# EasyEDA Pro project NFC1扩展板挖宝.epro

# Board NFC1扩展板
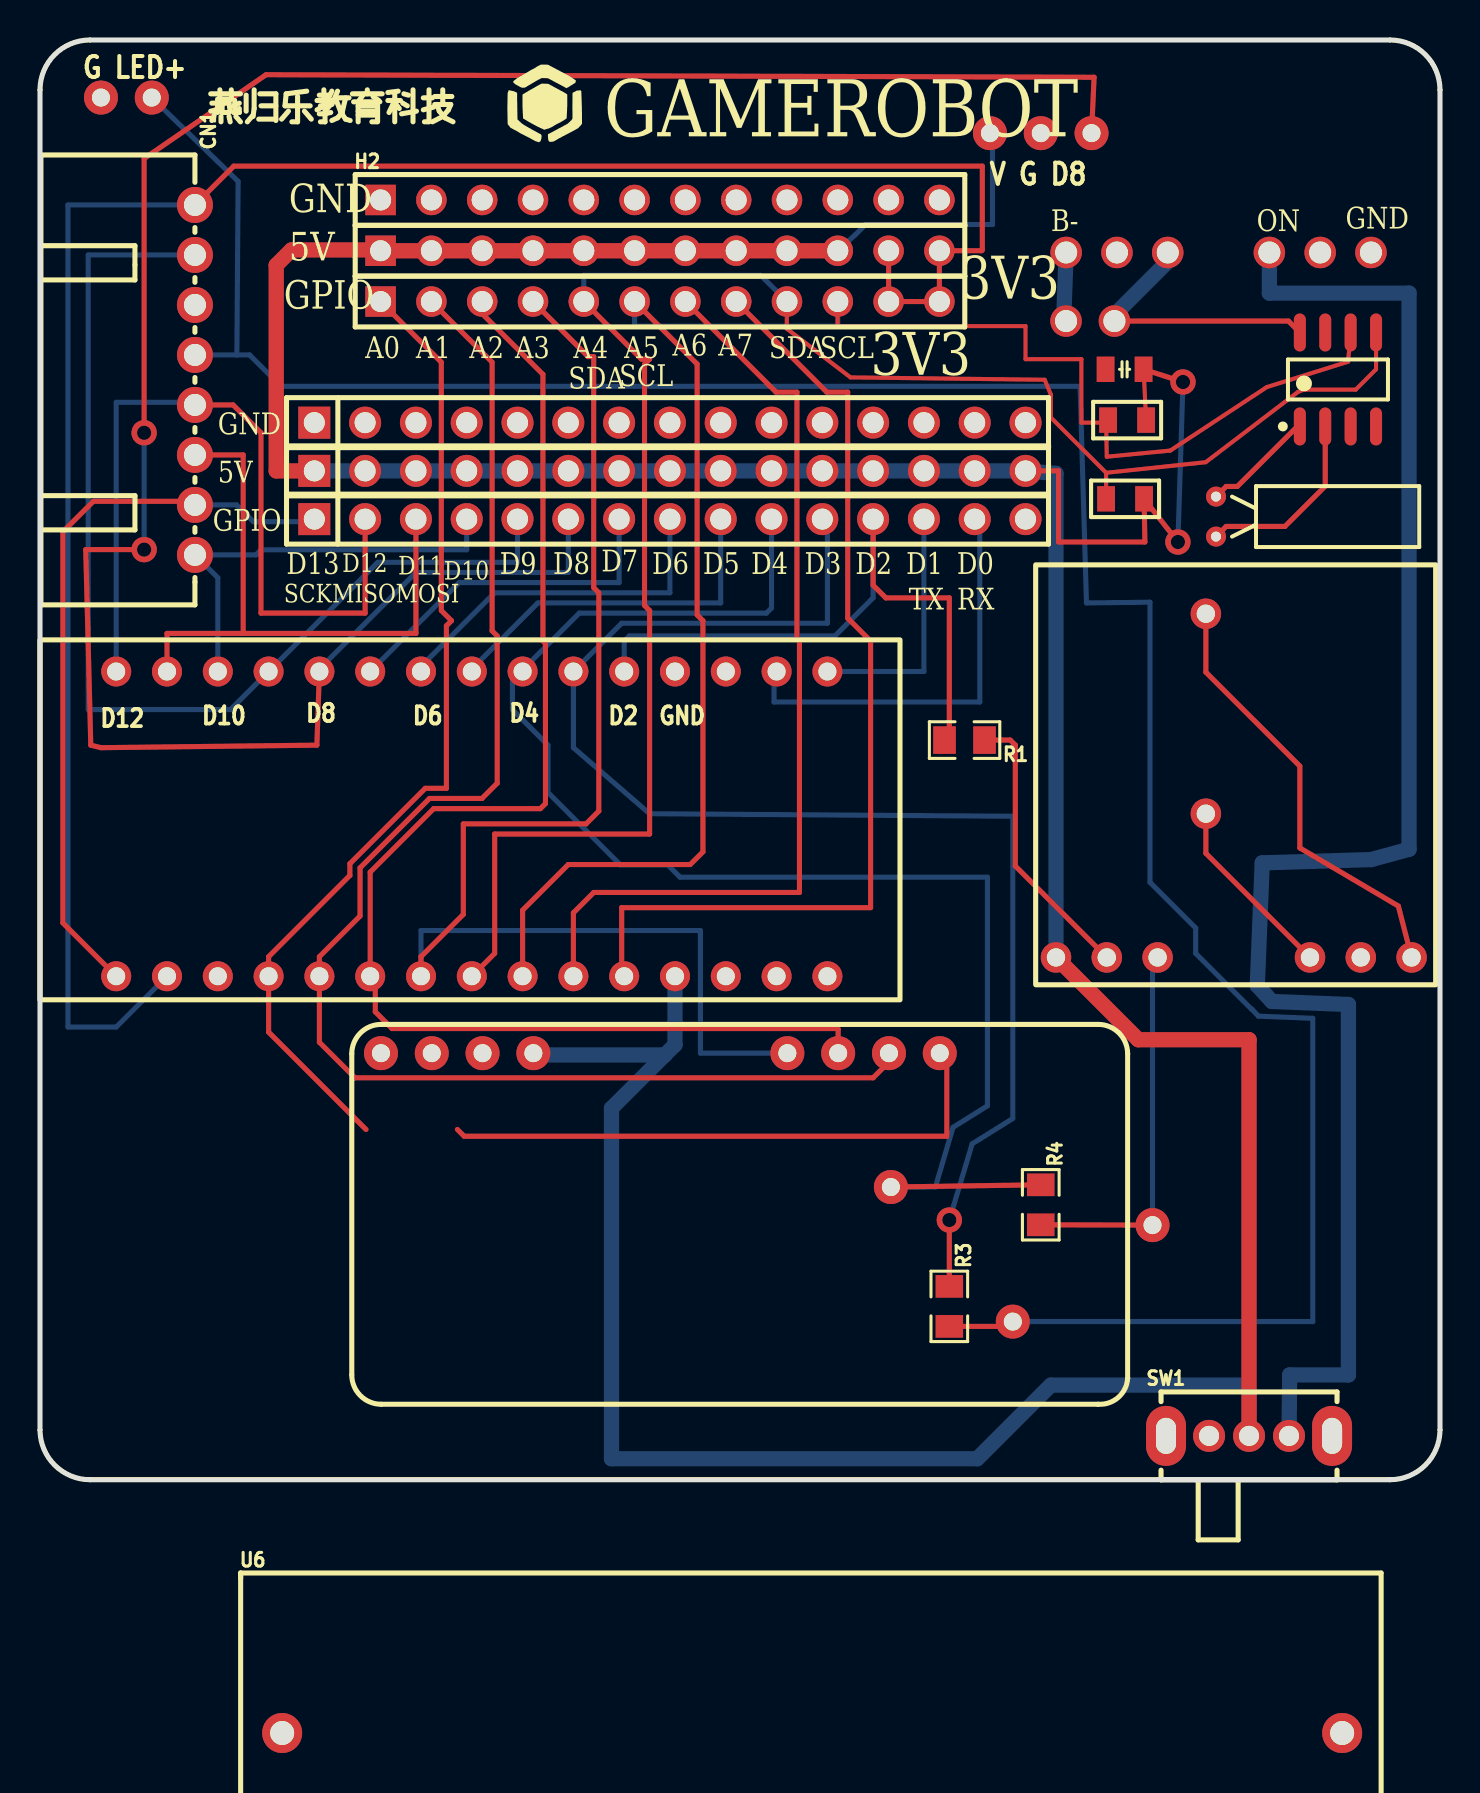
[diagram p0: board, top side]
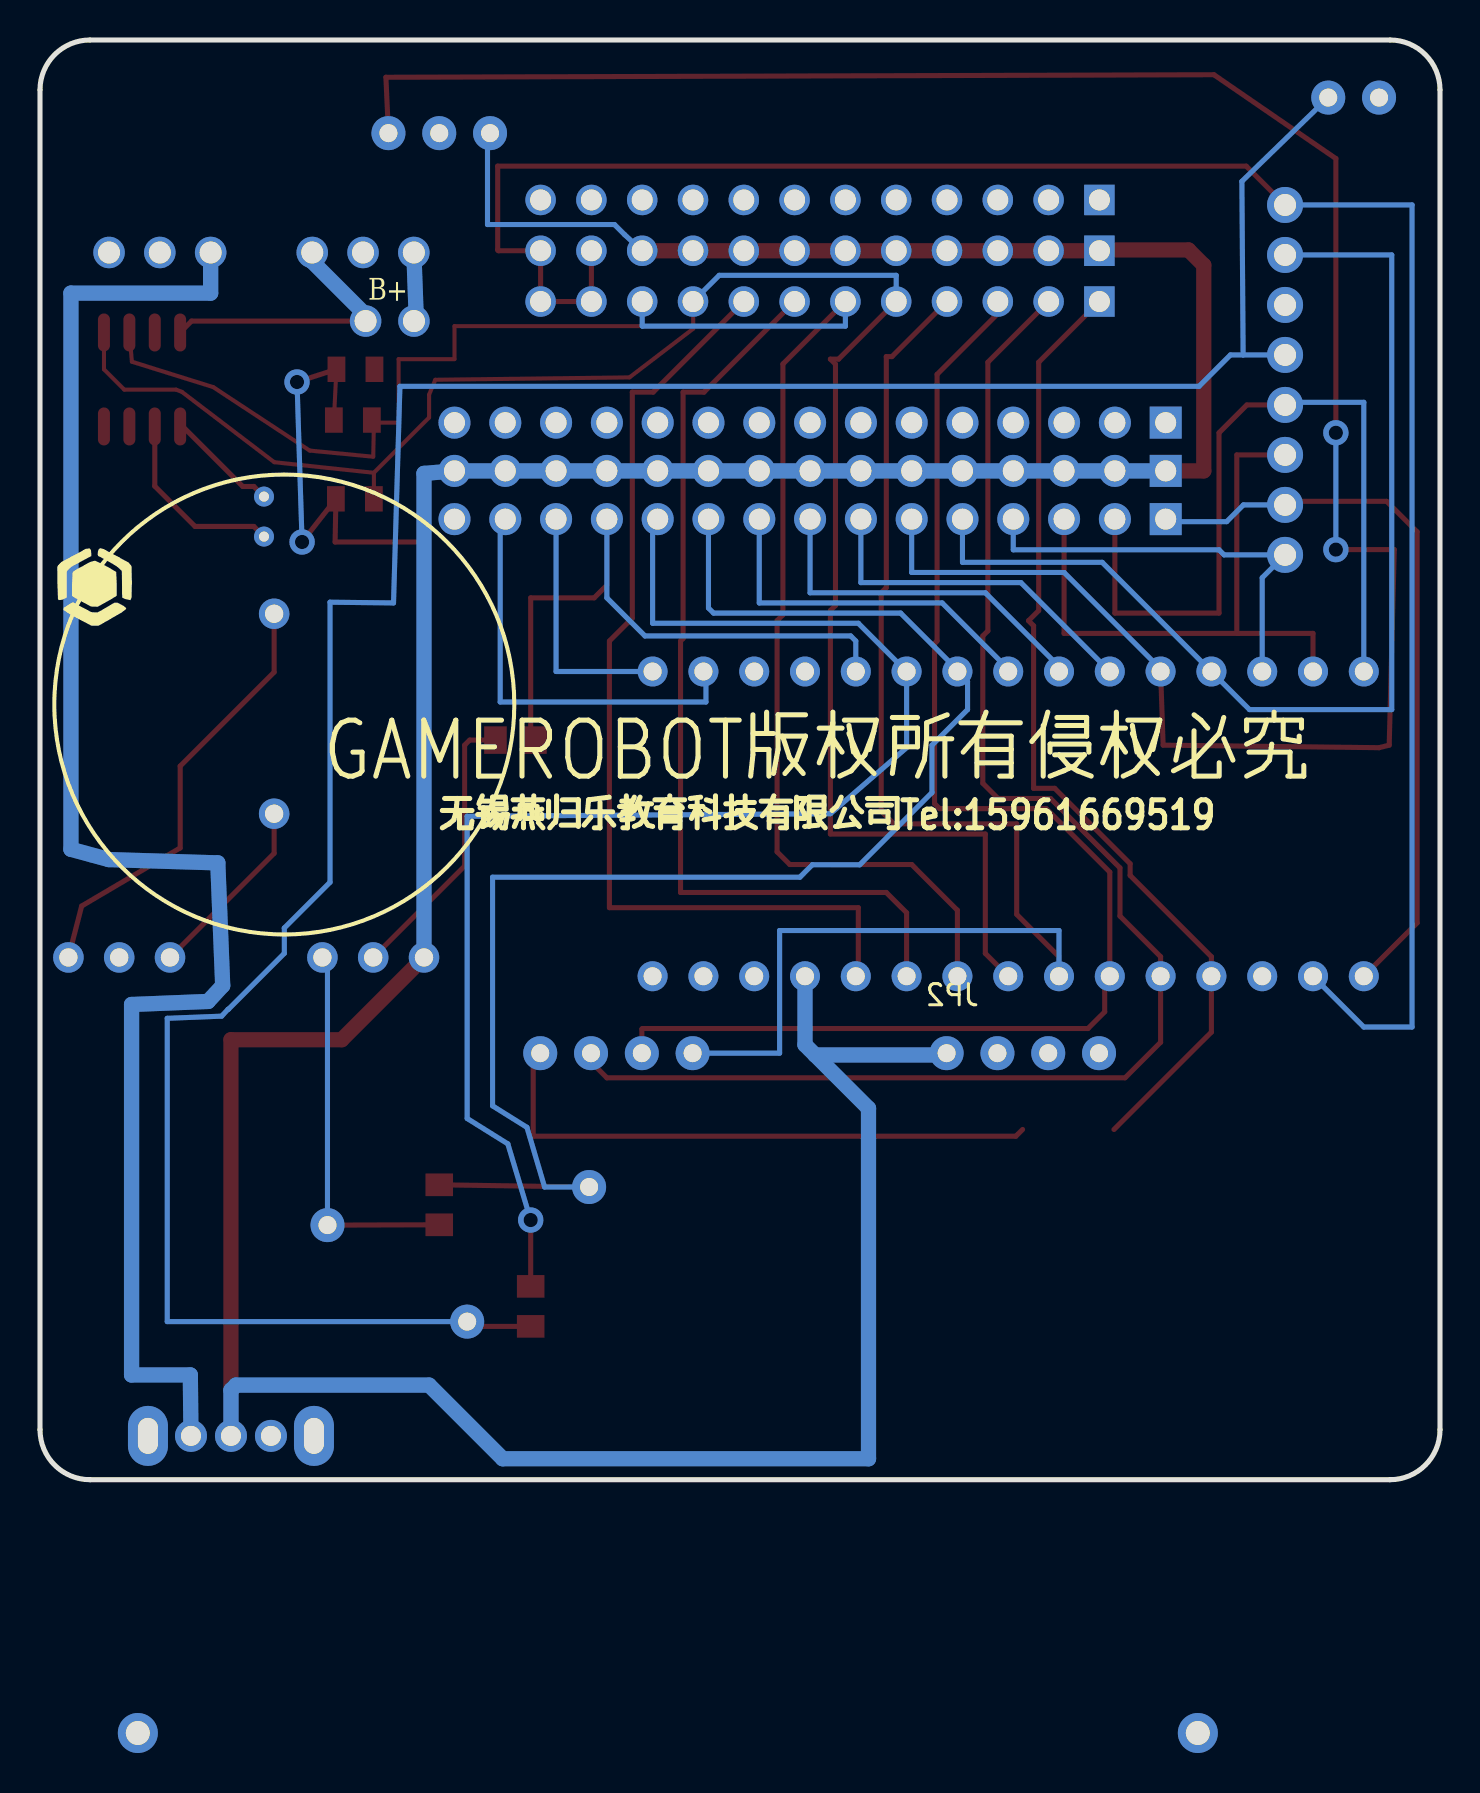
[diagram p1: board, bottom side, seen from below]

Outline 70 x 72 mm; copper layers: Top Layer, Bottom Layer. Coordinates in mm from the lower left corner of the outline.
Outline path: 0,69.5 0,2.5 arc(0.73,0.73) 2.5,0 67.5,0 arc(69.27,0.73) 70,2.5 70,69.5 arc(69.27,71.27) 67.5,72 2.5,72 arc(0.73,71.27) 0,69.5
Stack: Top Layer 0.0356mm / Dielectric1 0.32mm FR-4 er 4.8 / Bottom Layer 0.0356mm

## Design rules (mm)
template: 用户自定义配置
spacing Clearance (default): track to track 0.254, other pairs 0 to 0.254
track width Width (default): min 0.203, default 0.254, max 0.762
differential pair DiffPairsRouting (default): width min 0.381, default 0.381, max 0.381; gap min 0.254, default 0.254
via RoutingVias (default): diameter min 1.27, default 1.27, max 1.27; hole min 0.711, default 0.711, max 0.711

## Placement (name value [footprint] x y rotation side)
C20  104  [C 0805_L]  54.23 55.53 180 top
CN1  HX25003-8WAP  [CONN-TH_8P-P2.50_HX25003-8WAP]  7.75 55 270 top
H2  -  [HDR-TH_12P-P2.54-V-M]  31 64 0 top
H2#2  -  [HDR-TH_15P-P2.54-V-M]  31.5 52.86 0 top
H2#3  -  [HDR-TH_15P-P2.54-V-M]  31.5 50.45 0 top
H2#4  -  [HDR-TH_15P-P2.54-V-M]  31.5 48.04 0 top
H3  -  [HDR-TH_12P-P2.54-V-M]  31 61.46 0 top
H4  -  [HDR-TH_12P-P2.54-V-M]  31 58.92 0 top
JP2  Header-Male-2.54_1x15  [hdr-th_15p-p2.54-v-a]  21.59 25.18 180 top
JP3  Header-Male-2.54_1x15  [hdr-th_15p-p2.54-v-a]  21.59 40.42 180 top
NOREF  -  [Pad_e1]  47.5 67.34 0 top
NOREF#2  -  [Pad_e804]  64.01 61.37 0 top
NOREF#3  -  [Pad_e811]  53.85 61.37 0 top
NOREF#4  -  [Pad_e73]  61.47 61.37 0 top
NOREF#5  -  [Pad_ie26]  68.58 26.12 0 top
NOREF#6  -  [Pad_e23]  55.63 12.73 0 top
NOREF#7  -  [Pad_e749]  48.64 7.91 180 top
NOREF#8  -  [Pad_e82]  51.3 57.94 0 top
NOREF#9  -  [Pad_e423]  5.59 69.12 180 top
NOREF#10  -  [Pad_e232]  58.29 33.31 270 top
NOREF#11  -  [Pad_e75]  56.39 61.37 0 top
NOREF#12  -  [Pad_e425]  3.05 69.12 180 top
NOREF#13  -  [Pad_e9]  50.04 67.34 0 top
NOREF#14  -  [Pad_ie20]  63.5 26.12 0 top
NOREF#15  -  [Pad_e230]  58.29 43.31 270 top
NOREF#16  -  [Pad_ie16]  55.88 26.12 0 top
NOREF#17  -  [Pad_ie46]  24.67 21.33 180 top
NOREF#18  -  [Pad_ie15]  53.34 26.12 0 top
NOREF#19  -  [Pad_e12]  52.58 67.34 0 top
NOREF#20  -  [Pad_ie49]  17.05 21.33 180 top
NOREF#21  -  [Pad_ie12]  50.8 26.12 0 top
NOREF#22  -  [Pad_e81]  53.72 57.94 0 top
NOREF#23  -  [Pad_ie47]  22.13 21.33 180 top
NOREF#24  -  [Pad_ie45]  42.54 14.64 180 top
NOREF#25  -  [Pad_e7]  39.91 21.33 0 top
NOREF#26  -  [Pad_e76]  51.31 61.37 0 top
NOREF#27  -  [Pad_ie48]  19.59 21.33 180 top
NOREF#28  -  [Pad_ie25]  66.04 26.12 0 top
NOREF#29  -  [Pad_e8]  37.37 21.33 0 top
NOREF#30  -  [Pad_e6]  42.45 21.33 0 top
NOREF#31  -  [Pad_e5]  44.99 21.33 0 top
NOREF#32  -  [Pad_e67]  66.55 61.37 0 top
R1  10K  [R0805]  46.23 36.99 180 top
R3  1K  [R0805]  45.47 8.67 270 top
R4  1K  [R0805]  50.04 13.75 270 top
R16  10K  [R 0805_L]  54.36 52.99 0 top
R17  10K  [R 0805_L]  54.25 49.05 0 top
SW1  -  [拨动开关_侧]  60.45 2.19 0 top
U5  DS1307Z+T&R  [S8+2_L]  64.9 55.02 90 top
U6  1节5号电池座带焊针  [BAT-TH_L57.0-W16.0-P53.00]  38.61 -12.67 0 top
Y3  32.768kHz  [OSC-3x8-WI-A]  58.8 48.17 270 top

## Footprints (pads in the part's own frame, mm; a bottom-side part is the same pattern mirrored in y, then rotated)
BAT-TH_L57.0-W16.0-P53.00
  round 2 hole 1.2: 1(-26.5,0) 2(26.5,0)
C 0805_L
  rect 0.889x1.27 smd: 1(-0.95,0) 2(0.95,0)
CONN-TH_8P-P2.50_HX25003-8WAP
  round 1.8 hole 1.1: 1(-8.75,0) 2(-6.25,0) 3(-3.75,0) 4(-1.25,0) 5(1.25,0) 6(3.75,0) 7(6.25,0) 8(8.75,0)
HDR-TH_12P-P2.54-V-M
  rect 1.524x1.524 hole 1.05: 1(-13.97,0)
  round 1.524 hole 1.05: 2(-11.43,0) 3(-8.89,0) 4(-6.35,0) 5(-3.81,0) 6(-1.27,0) 7(1.27,0) 8(3.81,0) 9(6.35,0) 10(8.89,0) 11(11.43,0) 12(13.97,0)
hdr-th_15p-p2.54-v-a
  round 1.5 hole 0.9: 1(-17.78,0) 2(-15.24,0) 3(-12.7,0) 4(-10.16,0) 5(-7.62,0) 6(-5.08,0) 7(-2.54,0) 8(0,0) 9(2.54,0) 10(5.08,0) 11(7.62,0) 12(10.16,0) 13(12.7,0) 14(15.24,0) 15(17.78,0)
HDR-TH_15P-P2.54-V-M
  rect 1.6x1.6 hole 1.05: 1(-17.78,0)
  round 1.6 hole 1.05: 2(-15.24,0) 3(-12.7,0) 4(-10.16,0) 5(-7.62,0) 6(-5.08,0) 7(-2.54,0) 8(0,0) 9(2.54,0) 10(5.08,0) 11(7.62,0) 12(10.16,0) 13(12.7,0) 14(15.24,0) 15(17.78,0)
OSC-3x8-WI-A
  round 1 hole 0.5: 1(1,0) 2(-1,0)
Pad_e1
  round 1.7 hole 0.9: 21(0,0)
Pad_e5
  round 1.7 hole 0.9: 1(0,0)
Pad_e6
  round 1.7 hole 0.9: 2(0,0)
Pad_e7
  round 1.7 hole 0.9: 3(0,0)
Pad_e8
  round 1.7 hole 0.9: 4(0,0)
Pad_e9
  round 1.7 hole 0.9: 22(0,0)
Pad_e12
  round 1.7 hole 0.9: 23(0,0)
Pad_e23
  round 1.7 hole 0.9: 10(0,0)
Pad_e67
  round 1.575 hole 1.1: 1(0,0)
Pad_e73
  round 1.575 hole 1.1: 3(0,0)
Pad_e75
  round 1.575 hole 1.1: 3(0,0)
Pad_e76
  round 1.575 hole 1.1: 3(0,0)
Pad_e81
  round 1.575 hole 1.1: 3(0,0)
Pad_e82
  round 1.575 hole 1.1: 3(0,0)
Pad_e230
  round 1.524 hole 0.914: 2(0,0)
Pad_e232
  round 1.524 hole 0.914: 1(0,0)
Pad_e423
  round 1.7 hole 0.9: 21(0,0)
Pad_e425
  round 1.7 hole 0.9: 21(0,0)
Pad_e749
  round 1.7 hole 0.9: 1(0,0)
Pad_e804
  round 1.575 hole 1.1: 3(0,0)
Pad_e811
  round 1.575 hole 1.1: 3(0,0)
Pad_ie12
  round 1.524 hole 0.914: 12(0,0)
Pad_ie15
  round 1.524 hole 0.914: 12(0,0)
Pad_ie16
  round 1.524 hole 0.914: 12(0,0)
Pad_ie20
  round 1.524 hole 0.914: 12(0,0)
Pad_ie25
  round 1.524 hole 0.914: 11(0,0)
Pad_ie26
  round 1.524 hole 0.914: 11(0,0)
Pad_ie45
  round 1.7 hole 0.9: 0(0,0)
Pad_ie46
  round 1.7 hole 0.9: 0(0,0)
Pad_ie47
  round 1.7 hole 0.9: 0(0,0)
Pad_ie48
  round 1.7 hole 0.9: 0(0,0)
Pad_ie49
  round 1.7 hole 0.9: 0(0,0)
R0805
  rect 1.133x1.377 smd: 1(-1,0) 2(1,0)
R 0805_L
  rect 0.889x1.27 smd: 1(-0.95,0) 2(0.95,0)
S8+2_L
  oval 1.9x0.6 smd: 1(-2.35,1.905) 2(-2.35,0.635) 3(-2.35,-0.635) 4(-2.35,-1.905) 5(2.35,-1.905) 6(2.35,-0.635) 7(2.35,0.635) 8(2.35,1.905)
拨动开关_侧
  oval 1.6x1.6 hole 1.001: 1(-1.999,0) 2(0,0) 3(1.999,0)
  oval 1.999x2.999 hole 1.001x1.801: 4(4.151,0) 5(-4.151,0)

## Nets
3V3: CN1.1 H3.11 H3.12 H4.11 H4.12 JP2.14
GND: C20.2 CN1.3 H2.1 H2.2 H2.3 H2.4 H2.5 H2.6 H2.7 H2.8 H2.9 H2.10 H2.11 H2.12 H2#2.1 H2#2.2 H2#2.3 H2#2.4 H2#2.5 H2#2.6 H2#2.7 H2#2.8 H2#2.9 H2#2.10 H2#2.11 H2#2.12 H2#2.13 H2#2.14 H2#2.15 JP2.2 JP3.4 NOREF#12.21 NOREF#13.22 NOREF#27.0 NOREF#28.11 NOREF#32.1 U5.4
VCC: C20.1 H2#3.1 H2#3.2 H2#3.3 H2#3.4 H2#3.5 H2#3.6 H2#3.7 H2#3.8 H2#3.9 H2#3.10 H2#3.11 H2#3.12 H2#3.13 H2#3.14 H2#3.15 H3.1 H3.2 H3.3 H3.4 H3.5 H3.6 H3.7 H3.8 H3.9 H3.10 JP2.4 NOREF.21 NOREF#17.0 NOREF#21.12 R16.2 R17.2 SW1.2
VIN: JP2.1
A0: H4.1 JP2.12 NOREF#31.1
A1: H4.2 JP2.11 NOREF#30.2
A2: H4.3 JP2.10 NOREF#25.3
A3: H4.4 JP2.9 NOREF#29.4
A4/SDA: H4.5 H4.9 JP2.8 R17.1 U5.5
A5/SCL: H4.6 H4.10 JP2.7 R16.1 U5.6
A6: H4.7 JP2.6
A7: H4.8 JP2.5
AREF: JP2.13
B+: NOREF#11.3 NOREF#22.3 U5.8
B-: NOREF#8.3 NOREF#26.3
D0/RX: H2#4.14 JP3.2
D1/TX: H2#4.13 JP3.1
D1_2: U5.3
D2: H2#4.12 JP3.5 R1.2
D3: H2#4.11 JP3.6 R3.1
D4: H2#4.10 JP3.7 NOREF#24.0 R4.1
D5: H2#4.9 JP3.8
D6: H2#4.8 JP3.9
D7: H2#4.7 JP3.10
D8: H2#4.6 JP3.11 NOREF#19.23
D9: CN1.2 H2#4.5 JP3.12
D10/SS: CN1.8 H2#4.4 JP3.13
D11/MOSI: CN1.6 H2#4.3 JP3.14
D12/MISO: CN1.5 H2#4.2 JP3.15
D13/SCK: CN1.7 H2#4.1 JP2.15
LED+: CN1.4 NOREF#7.1 NOREF#9.21 R3.2
ON: NOREF#4.3 SW1.3
RX1: NOREF#18.12 R1.1
SPK1: NOREF#10.1 NOREF#14.12
SPK2: NOREF#5.11 NOREF#15.2
TX2: NOREF#6.10 NOREF#16.12 R4.2
Y1: U5.1 Y3.2
Y2: U5.2 Y3.1

Pads without a net: H2#4 15; JP2 3; JP3 3; NOREF#2 3; NOREF#3 3; NOREF#20 0; NOREF#23 0; SW1 1 4 5; U5 7; U6 1 2

## Via types
v1: diameter 1.27, hole 0.711, Top Layer to Bottom Layer, 5 vias

## Routing (per net, layer and track width the routed paths; a pad name or vN(x,y) marks a point on that pad's centre or on a via; arc(x,y) is an arc through that point)
3V3: length 107.6
  Top Layer w0.254: CN1.1 9.69,65.69 47.12,65.69 47.12,61.5 47.08,61.46 H3.12 H4.12 H4.11 H3.11
  Bottom Layer w0.254: JP2.14 3.81,22.64 1.4,22.64 1.4,63.75 CN1.1
VCC: length 240.8
  Top Layer w0.203: C20.1 R16.2
  Top Layer w0.254: C20.1 v1(57.15,54.9) ; H2#3.15 50.93,50.45 50.93,46.89 55.25,46.89 R17.2 v1(56.9,46.89)
  Top Layer w0.762: H2#3.1 11.81,50.45 11.81,60.74 12.57,61.5 16.99,61.5 H3.1 H3.2 H3.3 H3.4 H3.5 H3.6 H3.7 H3.8 H3.9 H3.10 ; NOREF#21.12 54.91,22 60.45,22 SW1.2
  Bottom Layer w0.254: NOREF.21 47.62,67.22 47.62,62.77 41.28,62.77 40.77,62.26 H3.10 ; v1(57.15,54.9) v1(56.9,46.89)
  Bottom Layer w0.762: 31.24,21.24 28.57,18.57 28.57,1.05 46.86,1.05 50.55,4.73 60.2,4.73 60.45,4.48 SW1.2 ; 31.24,21.24 31.75,21.75 JP2.4 ; 31.24,21.24 24.76,21.24 NOREF#17.0 ; H2#3.1 H2#3.2 H2#3.3 H2#3.4 H2#3.5 H2#3.6 H2#3.7 H2#3.8 H2#3.9 H2#3.10 H2#3.11 H2#3.12 H2#3.13 H2#3.14 H2#3.15 50.8,50.32 NOREF#21.12
A0: length 78.2
  Top Layer w0.254: 20.87,17.51 21.21,17.18 45.34,17.18 45.34,20.98 NOREF#31.1 ; 16.3,17.51 11.43,22.38 JP2.12 11.43,26.16 15.49,30.22 15.49,30.81 19.26,34.58 20.32,34.58 20.32,42.7 20.57,42.96 20.07,43.47 20.07,55.88 H4.1
A1: length 73.6
  Top Layer w0.254: H4.2 22.61,55.88 22.61,42.45 22.86,42.2 22.86,34.83 22.1,34.07 19.47,34.07 16,30.6 16,28.19 13.97,26.16 JP2.11 13.97,21.88 15.75,20.1 41.66,20.1 42.45,20.89 NOREF#30.2
A2: length 68.4
  Top Layer w0.254: H4.3 22.11,58.31 25.15,55.28 25.15,41.94 25.27,41.81 25.27,33.81 25.02,33.56 19.69,33.56 16.51,30.39 JP2.10 16.76,24.92 16.76,23.4 17.6,22.56 39.88,22.56 39.91,22.53 NOREF#25.3
A3: length 69.3
  Top Layer w0.254: JP2.9 19.05,26.16 21.17,28.27 21.17,32.8 27.31,32.8 27.94,33.43 27.94,44.36 27.69,44.61 27.69,56.17 27.4,56.17 H4.4
  Bottom Layer w0.254: JP2.9 19.05,27.46 33.02,27.46 33.02,21.33 NOREF#29.4
A4/SDA: length 95
  Top Layer w0.203: R17.1 53.3,50.35 53.3,50.36 ; 53.3,50.36 58.29,50.89 62.9,54.4 63.2,54.52 65.79,54.52 66.8,55.53 U5.5 ; 53.3,50.36 53.3,50.36 50.55,53.12 50.55,54.26 50.23,55.01 40.52,55.13 37.34,57.56 H4.9
  Top Layer w0.254: JP2.8 22.73,26.32 22.73,32.29 30.48,32.29 30.48,43.47 30.23,43.72 30.23,55.78 30.48,56.04 30.07,56.04 H4.5
  Bottom Layer w0.254: H4.5 27.19,60.23 36.04,60.23 H4.9
A5/SCL: length 91
  Top Layer w0.203: U5.6 65.41,55.91 61.34,54.64 56.51,51.47 53.34,51.16 53.3,52.86 52.07,52.86 52.07,56.04 49.28,56.04 49.28,57.69 39.88,57.69 H4.10
  Top Layer w0.254: JP2.7 24.13,28.48 26.42,30.77 32.51,30.77 33.15,31.4 33.15,42.96 32.85,43.25 32.85,55.8 H4.6
  Bottom Layer w0.254: H4.10 39.89,57.7 39.88,57.69 29.73,57.69 H4.6
A6: length 47.4
  Top Layer w0.254: H4.7 36.8,54.39 37.85,54.39 37.85,42.07 37.97,41.94 37.97,29.37 27.69,29.37 26.67,28.35 JP2.6
A7: length 49.6
  Top Layer w0.254: JP2.5 29.08,25.31 29.08,28.61 41.53,28.61 41.53,41.94 40.39,43.08 40.39,54.39 39.34,54.39 H4.8
B+: length 14
  Top Layer w0.254: U5.8 62.42,57.94 NOREF#22.3
  Bottom Layer w0.762: NOREF#22.3 53.72,58.25 56.39,60.92 NOREF#11.3
B-: length 3.4
  Bottom Layer w0.762: NOREF#26.3 51.18,57.94
D0/RX: length 21.3
  Bottom Layer w0.254: H2#4.14 46.99,48.04 46.99,38.89 36.7,38.89 36.7,40.42 JP3.2
D1/TX: length 12.4
  Bottom Layer w0.254: JP3.1 44.2,40.42 H2#4.13
D2: length 33.5
  Top Layer w0.254: 44.97,36.99 45.47,37.48 45.47,44.1 42.29,44.1 41.66,44.74 H2#4.12
  Bottom Layer w0.254: JP3.5 29.21,41.94 29.46,42.2 39.75,42.2 41.66,44.1 H2#4.12
D3: length 70.8
  Top Layer w0.254: v1(45.47,12.99) R3.1
  Bottom Layer w0.254: H2#4.11 39.37,47.78 39.37,42.83 29.08,42.83 JP3.6 26.67,36.61 30.48,33.31 48.64,33.18 48.64,18.07 46.61,16.8 v1(45.47,12.99)
D4: length 75.3
  Top Layer w0.254: NOREF#24.0 R4.1
  Bottom Layer w0.254: H2#4.10 36.58,43.59 36.32,43.34 26.97,43.34 24.13,40.5 JP3.7 23.62,39.91 23.62,38.51 25.4,36.73 25.4,34.37 29.01,30.75 31.38,30.75 32,30.13 47.37,30.13 47.37,18.7 45.65,17.62 44.77,14.64 NOREF#24.0
D5: length 18.1
  Bottom Layer w0.254: JP3.8 21.59,40.55 24.89,43.85 34.04,43.85 H2#4.9
D6: length 17.9
  Bottom Layer w0.254: H2#4.8 31.5,44.36 22.73,44.36 19.05,40.67 JP3.9
D7: length 17.5
  Bottom Layer w0.254: JP3.10 20.96,44.86 28.96,44.86 H2#4.7
D8: length 116.1
  Top Layer w0.254: v1(5.21,46.51) 2.29,46.51 2.54,36.73 3.05,36.61 13.84,36.73 JP3.11 ; NOREF#19.23 52.71,70.14 11.3,70.26 5.21,66.07 v1(5.21,52.36)
  Bottom Layer w0.254: H2#4.6 26.42,45.37 18.8,45.37 13.97,40.55 JP3.11 ; v1(5.21,52.36) v1(5.21,46.51)
D9: length 54.7
  Bottom Layer w0.254: H2#4.5 23.88,45.88 16.89,45.88 JP3.12 9.53,38.51 2.41,38.51 2.41,61.25 CN1.2
D10/SS: length 21.5
  Bottom Layer w0.254: JP3.13 8.89,45.11 CN1.8 10.8,46.25 11.05,46.5 21.34,46.5 H2#4.4
D11/MOSI: length 31.4
  Top Layer w0.254: 10.1,42.32 18.8,42.32 H2#4.3 ; 10.1,42.32 6.35,42.32 JP3.14 ; 10.1,42.32 10.16,42.38 10.16,51.25 CN1.6
D12/MISO: length 40.3
  Top Layer w0.254: H2#4.2 16.26,43.34 11.05,43.34 11.05,52.36 9.66,53.75 CN1.5
  Bottom Layer w0.254: CN1.5 7.62,53.88 3.81,53.88 JP3.15
D13/SCK: length 37
  Top Layer w0.254: JP2.15 1.14,27.84 1.14,47.4 2.67,48.93 7.57,48.93 CN1.7
  Bottom Layer w0.254: CN1.7 9.83,48.75 10.67,47.91 13.59,47.91 H2#4.1
LED+: length 132.7
  Top Layer w0.254: NOREF#7.1 48.4,7.67 R3.2
  Bottom Layer w0.254: 9.84,56.25 CN1.4 ; 9.84,56.25 9.91,64.93 NOREF#9.21 ; 9.84,56.25 10.48,56.25 12.05,54.68 52,54.68 52.32,43.85 55.5,43.88 55.5,29.88 57.78,27.59 57.78,26.32 60.58,23.53 60.6,23.53 60.92,23.18 63.64,23.07 63.64,7.91 NOREF#7.1
ON: length 79.8
  Bottom Layer w0.762: SW1.3 62.48,5.24 65.42,5.24 65.42,23.77 61.6,23.92 60.87,24.71 61.11,30.85 66.56,31.01 68.45,31.53 68.45,59.34 61.47,59.34 NOREF#4.3
RX1: length 14.4
  Top Layer w0.254: NOREF#18.12 48.77,30.69 48.77,36.73 48.51,36.99 46.97,36.99
SPK1: length 9.3
  Top Layer w0.254: NOREF#14.12 58.29,31.33 NOREF#10.1
SPK2: length 22
  Top Layer w0.254: NOREF#5.11 67.92,28.69 62.99,31.59 62.99,35.69 58.29,40.39 NOREF#15.2
TX2: length 19.1
  Top Layer w0.254: R4.2 NOREF#6.10
  Bottom Layer w0.254: NOREF#16.12 55.63,25.86 NOREF#6.10
Y1: length 5.7
  Top Layer w0.254: Y3.2 59.31,49.67 59.87,49.67 62.99,52.8
Y2: length 9.6
  Top Layer w0.254: Y3.1 59.31,47.67 62.25,47.67 64.26,49.69 64.26,52.8

## Text on the board
Bottom Silkscreen Layer: 无锡燕归乐教育科技有限公司Tel:15961669519 | GAMEROBOT版权所有侵权必究 | B+
Top Silkscreen Layer: D12 | D10 | D8 | D6 | D4 | D2 | GND | V G D8 | G LED+ | 燕归乐教育科技 | GAMEROBOT | SCK | MISO | MOSI | D11 | GPIO | 5V | D13 | A0 | A1 | A2 | D9 | A3 | SDA | A4 | D7 | SCL | A5 | A6 | D5 | A7 | D3 | D1 | TX | D0 | RX | B- | ON | 3V3
